# Altium schematic sheet [02] - BLOCK DIAGRAM.SchDoc: Block Diagram
size A4; DocumentNumber: 2; SheetNumber: 2; SheetTotal: 4
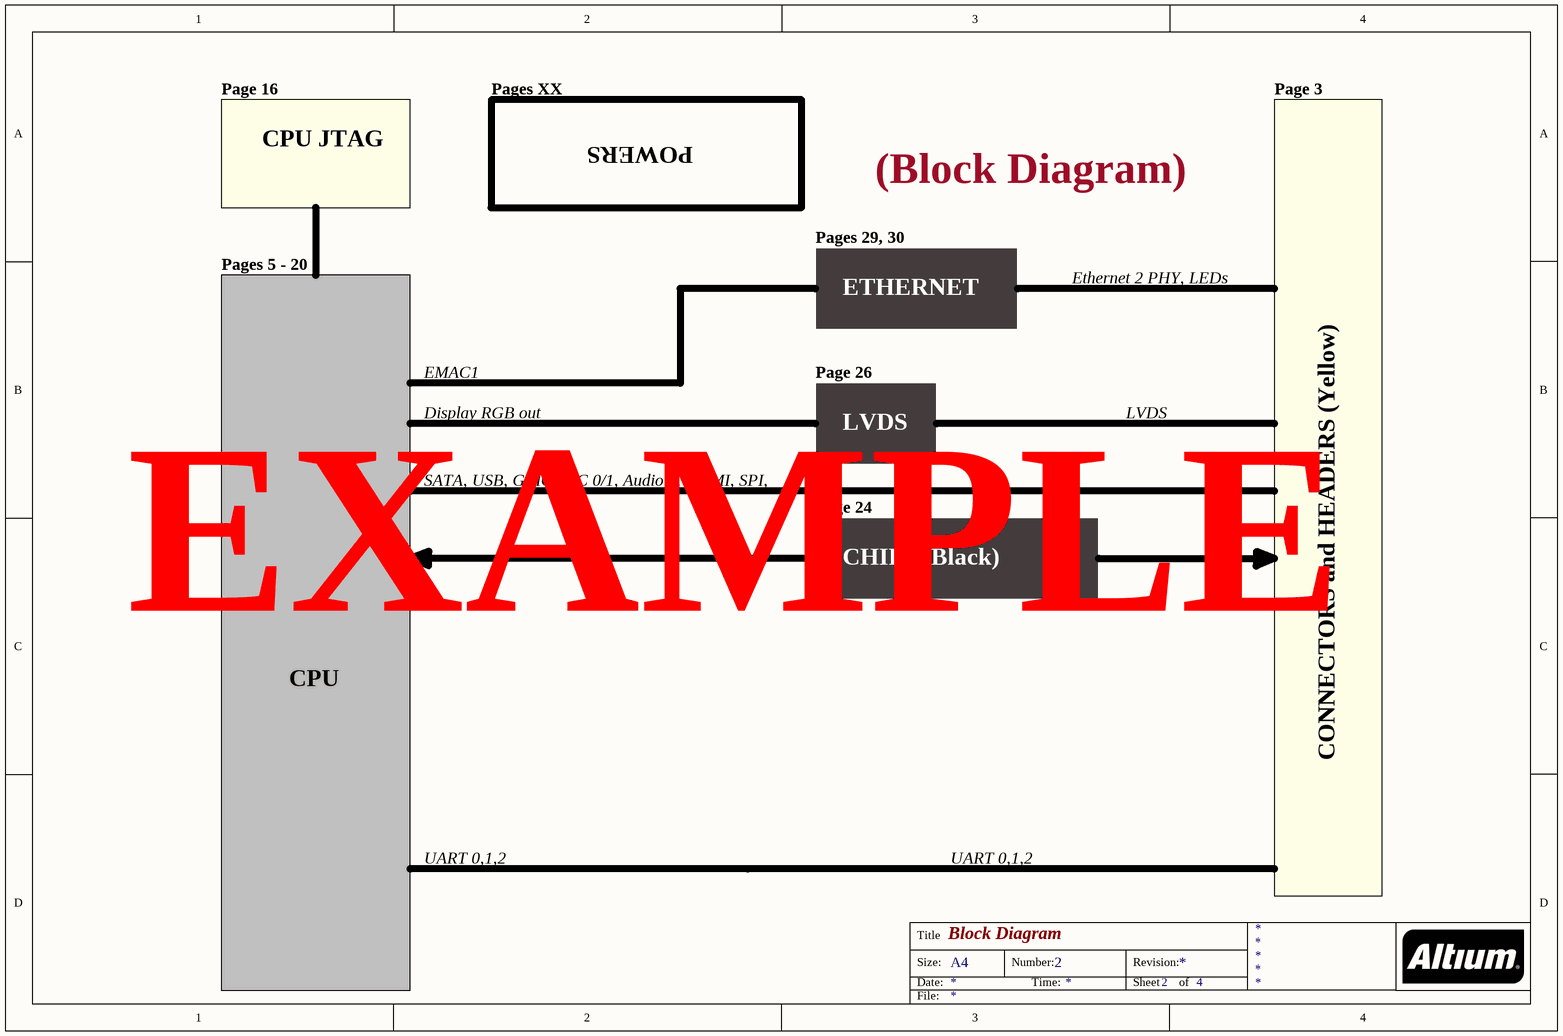
[diagram p0: [02] - BLOCK DIAGRAM.SchDoc]

## Notes on the sheet
- Page 16
- Pages XX
- Page 3
- CPU JTAG
- POWERS
- Pages 29, 30
- (Block Diagram)
- Pages 5 - 20
- ETHERNET
- Ethernet 2 PHY, LEDs
- EMAC1
- Page 26
- Display RGB out
- LVDS
- SATA, USB, GPIO, I2C 0/1, Audio 3, HDMI, SPI,
- Page 24
- CHIPS (Black)
- EXAMPLE
- CPU
- CONNECTORS and HEADERS (Yellow)
- UART 0,1,2
- FPGA
- Title
- Size:
- Date:
- A4
- Number:
- Time:
- Revision:
- Sheet
- of
- File: